# EAGLE design PCB-SSB-4x1 (EAGLE 6.4)
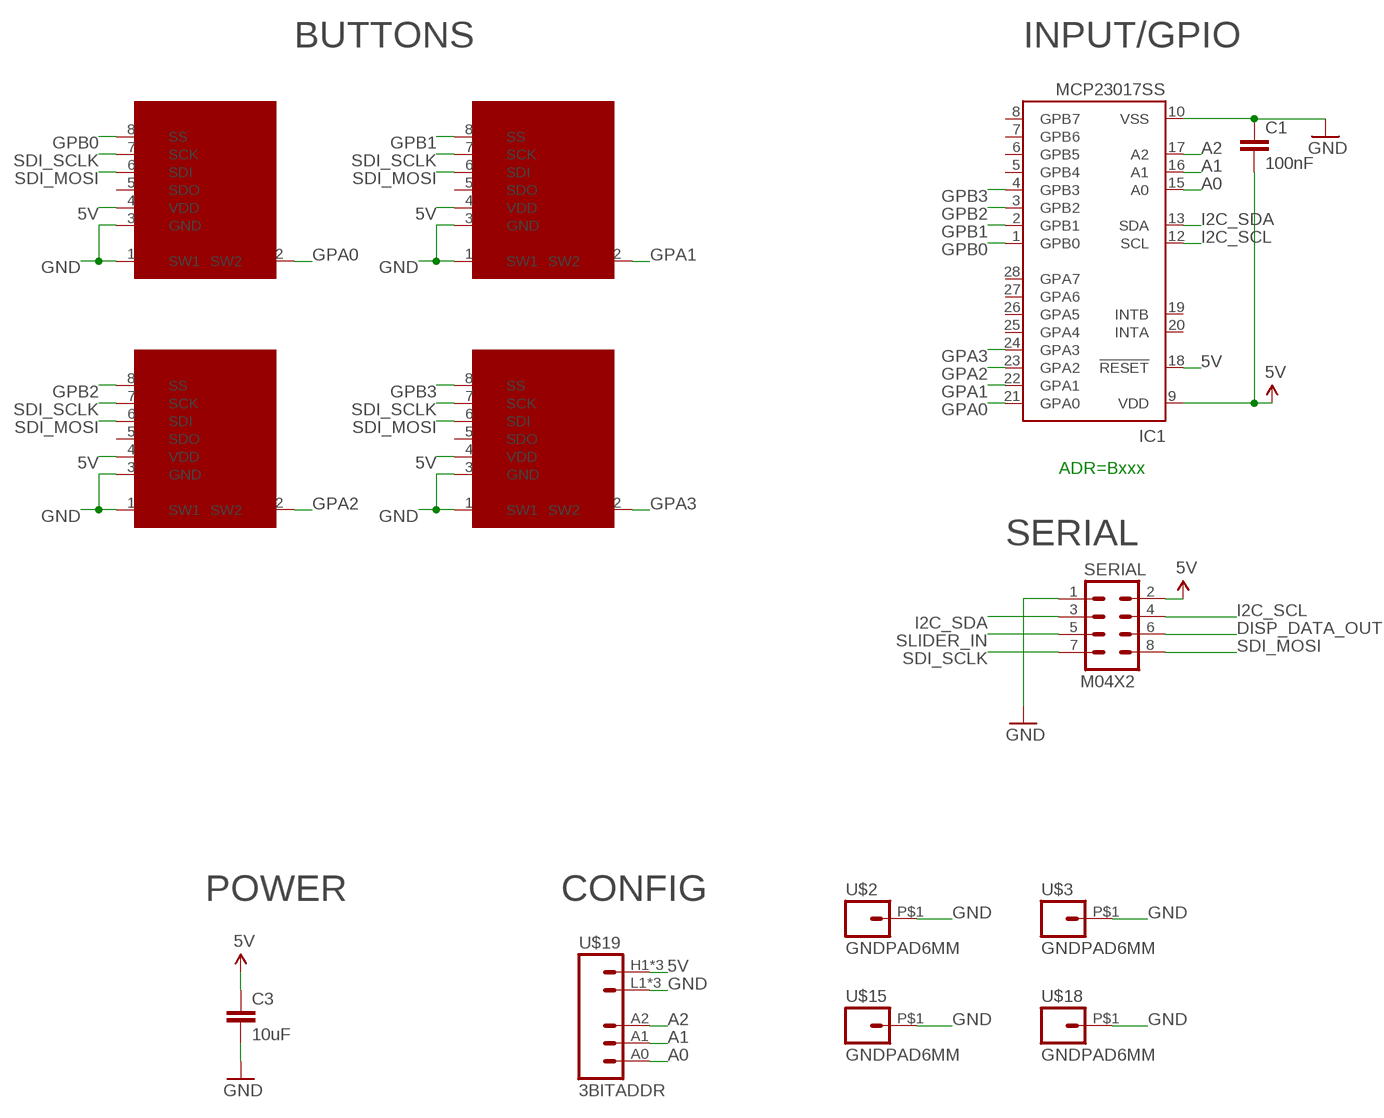
[diagram p0: schematic, sheet 1]

## Parts
C1  100nF  CAP0603-CAP  [0603-CAP]
C3  10uF  CAP0805  [0805]
IC1  MCP23017SS  [SSOP28]
SERIAL  M04X2  [2X4]
SSW1  SMART_SWITCHSMART_SWITCH_8PIN  [SMART_SWITCH]
SSW2  SMART_SWITCHSMART_SWITCH_8PIN  [SMART_SWITCH]
SSW3  SMART_SWITCHSMART_SWITCH_8PIN  [SMART_SWITCH]
SSW4  SMART_SWITCHSMART_SWITCH_8PIN  [SMART_SWITCH]
U$2  GNDPAD6MM  [3.2MMPAD6MM]
U$3  GNDPAD6MM  [3.2MMPAD6MM]
U$15  GNDPAD6MM  [3.2MMPAD6MM]
U$18  GNDPAD6MM  [3.2MMPAD6MM]
U$19  3BITADDR  [3BITADDR]

## Nets
5V [Power]: C1.2 C3.1 IC1.9(VDD) IC1.18(!RESET) SERIAL.2 SSW1.4(VDD) SSW2.4(VDD) SSW3.4(VDD) SSW4.4(VDD) U$19.H1(VCC) U$19.H2(VCC) U$19.H3(VCC)
A0: IC1.15(A0) U$19.A0
A1: IC1.16(A1) U$19.A1
A2: IC1.17(A2) U$19.A2
DISP_DATA_OUT: SERIAL.6
GND [Power]: C1.1 C3.2 IC1.10(VSS) SERIAL.1 SSW1.1(SW1) SSW1.3(GND) SSW2.1(SW1) SSW2.3(GND) SSW3.1(SW1) SSW3.3(GND) SSW4.1(SW1) SSW4.3(GND) U$2.P$1 U$3.P$1 U$15.P$1 U$18.P$1 U$19.L1(GND) U$19.L2(GND) U$19.L3(GND)
GPA0: IC1.21(GPA0) SSW1.2(SW2)
GPA1: IC1.22(GPA1) SSW2.2(SW2)
GPA2: IC1.23(GPA2) SSW3.2(SW2)
GPA3: IC1.24(GPA3) SSW4.2(SW2)
GPB0: IC1.1(GPB0) SSW1.8(SS)
GPB1: IC1.2(GPB1) SSW2.8(SS)
GPB2: IC1.3(GPB2) SSW3.8(SS)
GPB3: IC1.4(GPB3) SSW4.8(SS)
I2C_SCL: IC1.12(SCL) SERIAL.4
I2C_SDA: IC1.13(SDA) SERIAL.3
SDI_MOSI: SERIAL.8 SSW1.6(SDI) SSW2.6(SDI) SSW3.6(SDI) SSW4.6(SDI)
SDI_SCLK: SERIAL.7 SSW1.7(SCK) SSW2.7(SCK) SSW3.7(SCK) SSW4.7(SCK)
SLIDER_IN: SERIAL.5
Unconnected: IC1.5(GPB4) IC1.6(GPB5) IC1.7(GPB6) IC1.8(GPB7) IC1.19(INTB) IC1.20(INTA) IC1.25(GPA4) IC1.26(GPA5) IC1.27(GPA6) IC1.28(GPA7) SSW1.5(SDO) SSW2.5(SDO) SSW3.5(SDO) SSW4.5(SDO)

## Notes on the sheet
- BUTTONS | INPUT/GPIO
- ADR=Bxxx
- SERIAL
- POWER | CONFIG

## Library data of the parts
C1 C3 = SparkFun:CAP: Capacitor Standard 0603 ceramic capacitor, and 0.1" leaded capacitor.
IC1 = microchip:MCP23017: http://ww1.microchip.com/downloads/en/DeviceDoc/21952a.pdf Source: http://ww1.microchip.com/downloads/en/DeviceDoc/21952a.pdf; MF: MICROCHIP; MPN: MCP23017-E/SS; OC_FARNELL: 1467674; OC_NEWARK: 31K2960
SERIAL = SparkFun:M04X2
SSW1-SSW4 = SKAARHOJ:SMART_SWITCH: SMARTSWITCH IS15DSBFP4RGB www.nkksmartswitch.com
U$2 U$3 U$15 U$18 = SKAARHOJ:GNDPAD
U$19 = SKAARHOJ:3BITADDR

## Net classes
0 default: width 0.203 mm, drill 0.406 mm, clearance 0.203 mm
1 Power: width 0.406 mm, drill 0.61 mm, clearance 0.203 mm

## Board
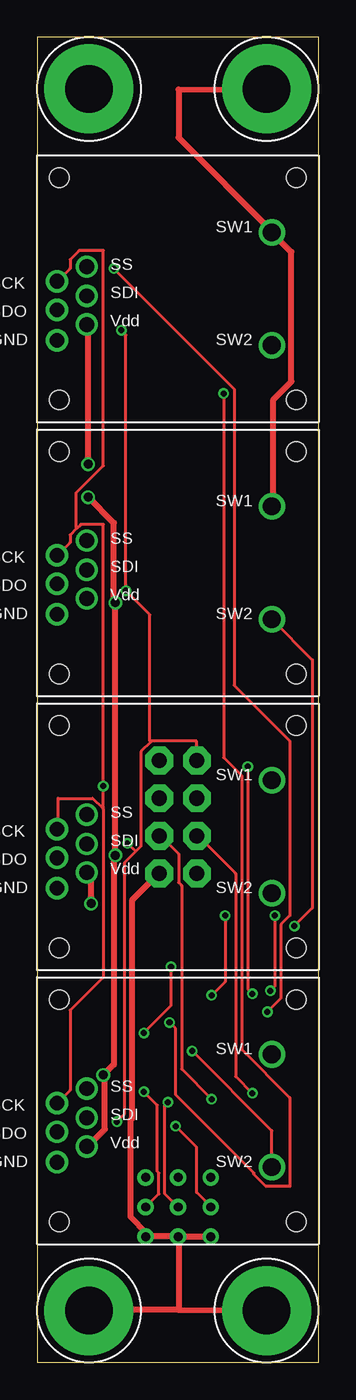
[diagram p1: board, top side]
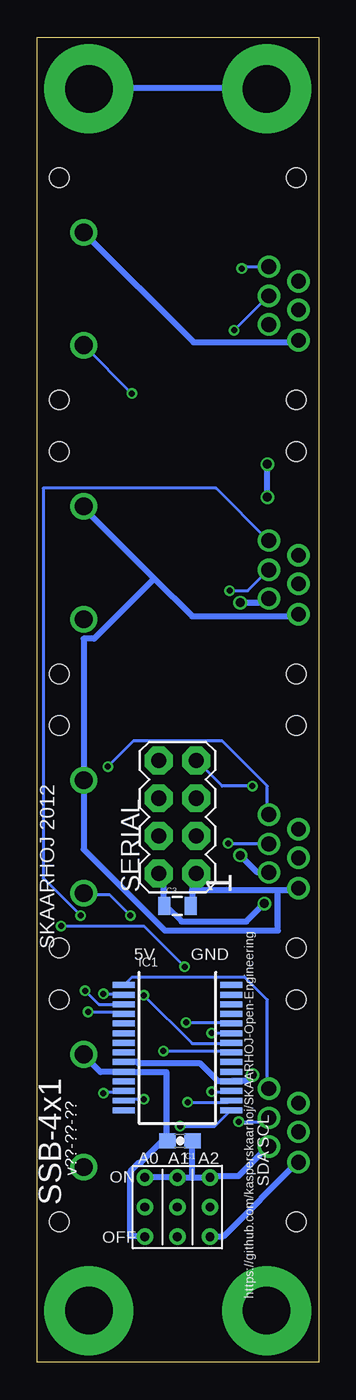
[diagram p2: board, bottom side, seen from below]

Size 19 x 89.5 mm. Coordinates in mm from the lower left corner, seen from the top.
Outline: 0,0 19,0 19,89.5 0,89.5 0,0
Copper layers (1*16): Top 0.035mm / dielectric 1.5mm / Bottom 0.035mm
Design rules "default": minimum track width 6mil, minimum drill 12mil, track to track 6mil, track to pad 6mil, pad to pad 6mil, via to via 6mil, smd to smd 0mil, copper to edge 10mil, drill to drill 10mil, minimum pad ring 10mil, minimum via ring 6mil, stop-mask expansion 2mil, vias tented up to drill 100mil, thermal gap 10mil

### Footprints (pad centres in the part's own frame; a part is rotated, then mirrored left to right if it is on the bottom)
0603-CAP = smd 1.1 x 1: 1 -0.85,0; 2 0.85,0
0805 = smd 0.8 x 1.2: 1 -0.9,0; 2 0.9,0
SSOP28 = smd 0.4 x 1.5: 1 -4.225,-3.625; 2 -3.575,-3.625; 3 -2.925,-3.625; 4 -2.275,-3.625; 5 -1.625,-3.625; 6 -0.975,-3.625; 7 -0.325,-3.625; 8 0.325,-3.625; 9 0.975,-3.625; 10 1.625,-3.625; 11 2.275,-3.625; 12 2.925,-3.625; 13 3.575,-3.625; 14 4.225,-3.625; 15 4.225,3.625; 16 3.575,3.625; 17 2.925,3.625; 18 2.275,3.625; 19 1.625,3.625; 20 0.975,3.625; 21 0.325,3.625; 22 -0.325,3.625; 23 -0.975,3.625; 24 -1.625,3.625; 25 -2.275,3.625; 26 -2.925,3.625; 27 -3.575,3.625; 28 -4.225,3.625
2X4 = drill 1.016 pad 1.88 octagon: 1 -3.81,-1.27; 2 -3.81,1.27; 3 -1.27,-1.27; 4 -1.27,1.27; 5 1.27,-1.27; 6 1.27,1.27; 7 3.81,-1.27; 8 3.81,1.27
SMART_SWITCH = drill 1.2: 1 6.35,3.81; 2 6.35,-3.81 | drill 1: 3 -8.153,-3.48; 4 -6.147,-2.413; 5 -8.153,-1.422; 6 -6.147,-0.483; 7 -8.153,0.508; 8 -6.147,1.499 | hole 1.3: -8.001,7.506; 8.001,7.506; 8.001,-7.506; -8.001,-7.506
3.2MMPAD6MM = drill 3.2 pad 6: P$1 0,0
3BITADDR = drill 0.6: A0 -2.2,0; A1 0,0; A2 2.2,0; H1 -2.2,2; H2 0,2; H3 2.2,2; L1 -2.2,-2; L2 0,-2; L3 2.2,-2

### Placement (x,y rotation side)
C1  9.35,14.96 0 bottom
C3  9.53,30.84 0 bottom
IC1  9.53,21.26 270 bottom
SERIAL  9.53,36.83 90 bottom
SSW1  9.5,17 0 top
SSW2  9.5,35.5 0 top
SSW3  9.5,54 0 top
SSW4  9.5,72.5 0 top
U$2  3.5,3.5 0 top
U$3  3.5,86 0 top
U$15  15.5,3.5 0 top
U$18  15.5,86 0 top
U$19  9.53,10.49 0 bottom

### Tracks (layer width: path | path; a pad name or v marks a point on that pad's centre or on a via)
5V  (via drill 0.61)
  Top 0.406: SSW1.4 3.45,14.63 4.57,15.75 4.57,19.3 v4.47,19.41 5.18,20.12 5.18,34.14 v5.28,34.24 v5.28,51.31 5.18,51.41 5.18,56.69 v3.45,58.42 | v3.66,30.99 3.66,32.82 3.45,33.02 SSW2.4 | v3.45,60.66 3.45,70 SSW4.4
  Bottom 0.406: IC1.9 13.11,20.32 12.29,20.32 12.19,20.22 8.03,20.22 6.81,19 5.99,19 IC1.18 5.79,19 4.88,19 v4.47,19.41 | 8.53,12.5 8.53,14.94 C1.2 | 8.53,12.5 9.45,12.5 U$19.H2 9.65,12.5 11.68,12.5 U$19.H1 | 8.53,12.5 7.42,12.5 U$19.H3 7.21,12.6 5.38,12.6 3.45,14.53 SSW1.4 | SERIAL.2 10.46,33.02 10.46,30.89 C3.1 10.26,30.79 9.25,29.77 4.88,29.77 v3.66,30.99 | v5.28,51.31 3.66,51.31 3.45,51.51 SSW3.4 | v5.28,34.24 4.17,33.12 3.45,33.12 SSW2.4 | v3.45,58.42 v3.45,60.66
A0  (via drill 0.41)
  Top 0.203: v9.35,15.95 10.77,14.53 10.77,11.48 11.68,10.57 U$19.A0
  Bottom 0.203: v9.35,15.95 7.01,15.95 5.99,16.97 IC1.15
A1  (via drill 0.41)
  Top 0.203: v8.84,17.58 8.64,17.37 8.64,11.38 U$19.A1
  Bottom 0.203: v8.84,17.58 6.1,17.58 5.99,17.68 IC1.16
A2  (via drill 0.41)
  Top 0.203: v7.21,18.29 8.13,17.37 8.13,12.9 8.23,12.8 8.23,11.38 7.42,10.57 U$19.A2
  Bottom 0.203: v7.21,18.29 5.99,18.29 IC1.17
GND
  Top 0.406: U$19.L2 9.45,8.53 7.42,8.53 U$19.L3 7.42,8.74 6.3,9.86 6.3,16.36 6.4,16.46 6.4,31.19 8.23,33.02 SERIAL.1 | U$19.L1 11.68,8.53 9.65,8.53 U$19.L2 | 9.55,3.56 9.55,8.33 U$19.L2 | 9.55,3.56 U$15.P$1 | U$18.P$1 9.55,85.95 9.55,82.7 15.85,76.4 SSW4.1 15.95,76.2 17.17,74.98 17.17,66.24 15.95,65.02 15.95,57.81 SSW3.1 | 9.55,3.56 3.56,3.56 U$2.P$1
  Bottom 0.406: SSW1.1 15.85,20.73 14.73,19.61 13.31,19.61 IC1.10 13.11,19.61 10.26,19.61 10.26,15.04 C1.1 10.46,15.04 11.99,13.51 12.09,13.51 12.7,12.9 12.7,8.53 11.79,8.53 U$19.L1 | SSW1.3 1.42,13.51 6.4,8.53 7.32,8.53 U$19.L3 | SSW4.3 1.42,68.99 1.52,68.89 8.43,68.89 SSW4.1 | 8.53,31.9 8.53,33.02 SERIAL.1 | 8.53,31.9 8.53,30.89 C3.2 | 8.53,31.9 2.74,31.9 | 2.74,31.9 1.52,31.9 1.42,32 SSW2.3 | 11.07,52.93 15.85,57.71 SSW3.1 | 11.07,52.93 8.53,50.39 1.52,50.39 1.42,50.49 SSW3.3 | 11.07,52.93 15.14,48.87 15.85,48.87 SSW2.1 15.85,39.12 15.85,34.65 10.36,29.16 2.74,29.16 2.74,31.9 | U$18.P$1 15.44,86.06 3.56,86.06 U$3.P$1
GPA0  (via drill 0.41)
  Top 0.203: v10.46,21.03 15.85,15.65 15.85,13.21 SSW1.2
  Bottom 0.203: v10.46,21.03 5.99,21.03 IC1.21
GPA1  (via drill 0.41)
  Top 0.203: v11.79,24.79 12.7,25.7 v12.7,30.18
  Bottom 0.203: v11.79,24.79 8.53,21.54 5.99,21.54 IC1.22 | v12.7,30.18 14.12,31.6 15.85,31.6 SSW2.2
GPA2  (via drill 0.41)
  Top 0.203: v7.21,22.25 9.04,24.08 v9.04,26.72 | v17.37,29.46 18.59,30.68 18.59,47.45 SSW3.2
  Bottom 0.203: v7.21,22.25 5.99,22.25 IC1.23 | v9.04,26.72 11.79,29.46 v17.37,29.46
GPA3  (via drill 0.41)
  Top 0.203: v8.94,22.96 9.35,22.55 9.35,18.09 14.63,12.8 14.63,12.7 15.44,11.89 17.07,11.89 17.07,17.88 13.82,21.13 13.82,39.62 12.6,40.84 v12.6,65.43
  Bottom 0.203: v8.94,22.96 5.99,22.96 IC1.24 | v12.6,65.43 SSW4.2
GPB0
  Bottom 0.203: IC1.1 13.11,25.5 12.6,26.01 4.98,26.01 3.45,24.49 3.45,18.59 SSW1.8
GPB1  (via drill 0.41)
  Top 0.203: v14.53,24.89 14.22,25.2 v14.22,40.23
  Bottom 0.203: v14.53,24.89 13.21,24.89 IC1.2 | v14.22,40.23 12.5,41.96 6.5,41.96 3.45,38.91 3.45,37.08 SSW2.8
GPB2  (via drill 0.41)
  Top 0.203: v15.75,25.09 16.05,25.4 v16.05,30.18
  Bottom 0.203: v15.75,25.09 14.83,24.18 13.21,24.18 IC1.3 | v16.05,30.18 18.59,32.72 18.59,59.03 6.91,59.03 3.45,55.58 SSW3.8
GPB3  (via drill 0.41)
  Top 0.203: v15.54,23.67 16.46,24.59 16.46,29.57 17.07,30.18 17.07,41.96 13.31,45.72 13.31,65.73 v5.18,73.86
  Bottom 0.203: v15.54,23.67 13.31,23.67 13.21,23.57 IC1.4 | v5.18,73.86 5.08,73.97 3.45,73.97 SSW4.8
I2C_SCL  (via drill 0.41)
  Top 0.203: v14.53,18.19 13.41,19.3 13.41,33.02 10.87,35.56 SERIAL.4
  Bottom 0.203: v14.53,18.19 14.43,18.29 13.21,18.29 IC1.12
I2C_SDA  (via drill 0.41)
  Top 0.203: v11.79,17.78 9.75,19.81 9.75,32.21 9.55,32.41 9.55,34.34 8.33,35.56 SERIAL.3
  Bottom 0.203: v11.79,17.78 13.11,17.78 IC1.13
SDI_MOSI  (via drill 0.41)
  Top 0.203: v5.38,16.26 5.89,16.76 5.89,33.73 6.66,34.49 | 6.66,34.49 7.01,34.85 7.01,41.25 7.67,41.91 | 7.67,41.91 7.72,41.96 10.77,41.96 10.77,40.64 SERIAL.8 | 6.66,34.49 v6.1,35.05 | 7.67,41.91 7.62,41.96 7.62,50.49 v5.99,52.12 5.99,69.39 v5.69,69.7
  Bottom 0.203: v5.38,16.26 3.66,16.26 3.45,16.46 SSW1.6 | v6.1,35.05 3.45,35.05 SSW2.6 | v5.99,52.12 4.78,52.12 3.45,53.44 SSW3.6 | v5.69,69.7 3.45,71.93 SSW4.6
SDI_SCLK  (via drill 0.41)
  Top 0.203: 4.42,37.44 3.76,38.1 1.42,38.1 1.42,36.07 SSW2.7 | 4.42,37.44 4.47,37.39 4.47,26.01 2.23,23.77 2.23,18.39 1.42,17.58 SSW1.7 | 2.69,56.34 2.95,56.59 4.47,56.59 v4.47,38.91 4.47,37.49 4.42,37.44 | 2.69,56.34 2.23,55.88 2.23,55.37 1.42,54.56 SSW3.7 | SSW4.7 1.42,73.05 2.23,73.86 2.23,74.47 2.85,75.08 4.47,75.08 4.47,60.55 2.64,58.73 2.64,56.39 2.69,56.34
  Bottom 0.203: v4.47,38.91 6.5,38.91 8.23,40.64 SERIAL.7

### Text on the board
_bsilk: SKAARHOJ 2012 | 1 | GND | 5V | SSB-4x1 | v??-??-?? | SCL | SDA | https://github.com/kasperskaarhoj/SKAARHOJ-Open-Engineering